# Altium schematic sheet Sheet2.SchDoc
size A
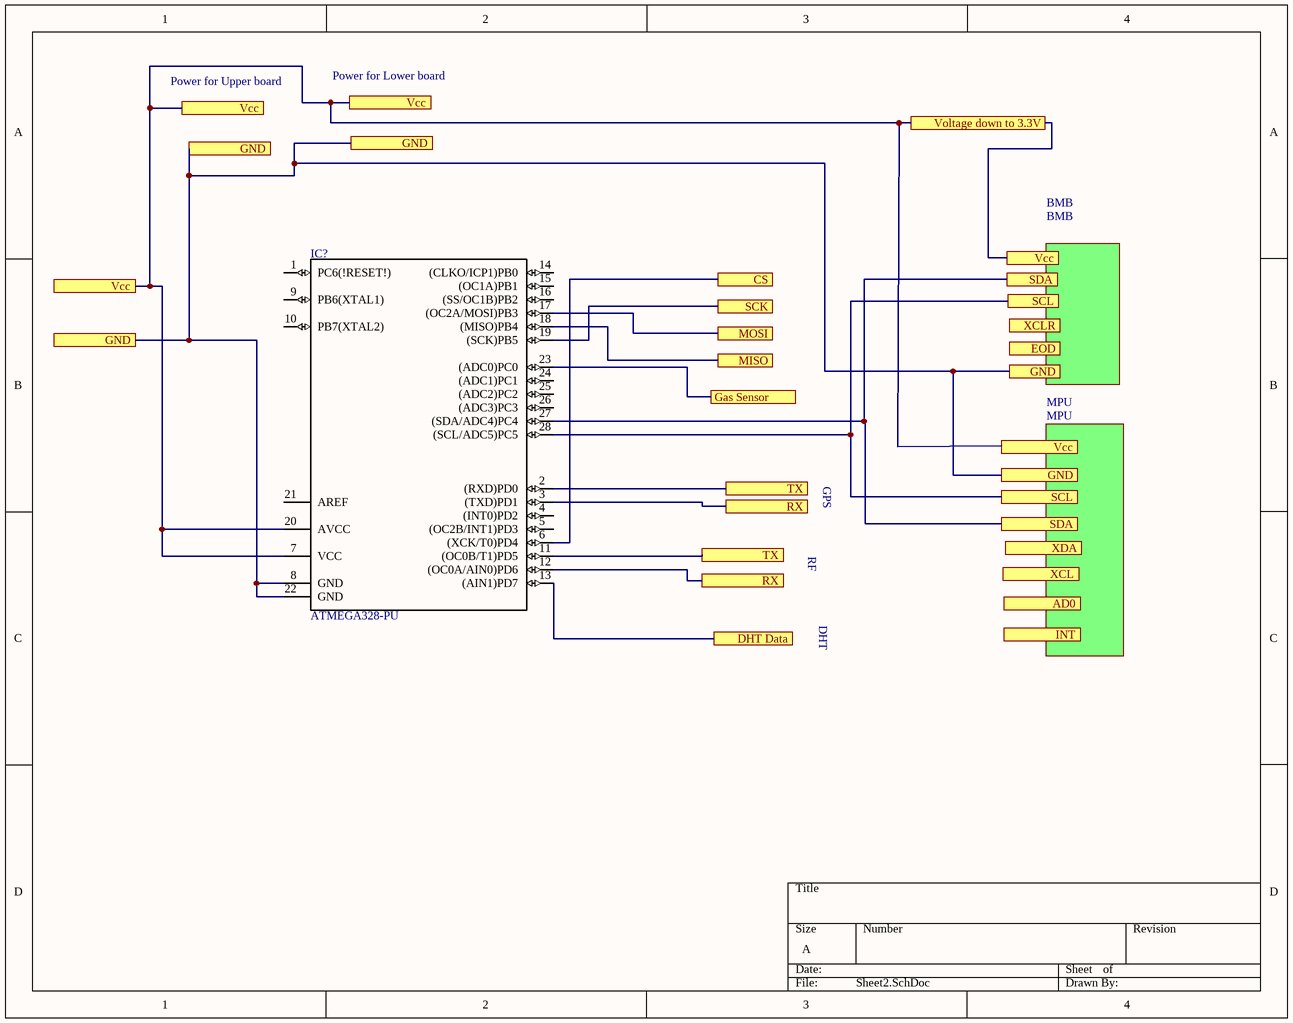
[diagram p0: Sheet2.SchDoc]

## Parts
IC?  ATMEGA328-PU  [*DIL28]

## Sub-sheets
BMB = BMB: no entries
MPU = MPU: no entries

## Ports
AD0, CS, DHT Data, EOD, Gas Sensor, GND, INT, MISO, MOSI, RX, SCK, SCL, SDA, TX, Vcc, Voltage down to 3.3V, XCL, XCLR, XDA

## Nets
CS: IC?.6((XCK/T0)PD4) ; port CS
DHT Data: IC?.13((AIN1)PD7) ; port DHT Data
Gas Sensor: IC?.23((ADC0)PC0) ; port Gas Sensor
GND: IC?.8(GND) IC?.22(GND) ; port GND
MISO: IC?.18((MISO)PB4) ; port MISO
MOSI: IC?.17((OC2A/MOSI)PB3) ; port MOSI
RX: IC?.3((TXD)PD1) IC?.12((OC0A/AIN0)PD6) ; port RX
SCK: IC?.19((SCK)PB5) ; port SCK
SCL: IC?.28((SCL/ADC5)PC5) ; port SCL
SDA: IC?.27((SDA/ADC4)PC4) ; port SDA
TX: IC?.2((RXD)PD0) IC?.11((OC0B/T1)PD5) ; port TX
Vcc: IC?.7(VCC) IC?.20(AVCC) ; port Vcc, port Voltage down to 3.3V

Not connected (* = marked no-connect by the designer): IC? 1(PC6(!RESET!)) 4((INT0)PD2) 5((OC2B/INT1)PD3) 9(PB6(XTAL1)) 10(PB7(XTAL2)) 14((CLKO/ICP1)PB0) 15((OC1A)PB1) 16((SS/OC1B)PB2) 21(AREF) 24((ADC1)PC1) 25((ADC2)PC2) 26((ADC3)PC3)

## Notes on the sheet
- Power for Upper board
- Power for Lower board
- GPS
- RF
- DHT

## Library data of the parts
IC? = ATMEGA328-PU: ATmega Series 20 MHz 32 KB Flash 2 KB SRAM 8-Bit Microcontroller - DIP-28; MF: Microchip; Package: PDIP-28 Microchip; Price: None; MP: ATMEGA328-PU; SnapEDA_Link: https://www.snapeda.com/parts/ATMEGA328-PU/Microchip/view-part/?ref=snap; Availability: Unavailable; Value: *